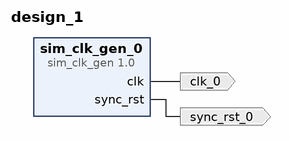
[diagram p0: block diagram of the top level]
# Vivado block design design_1, xc7a35tcpg236-1, Vivado 2017.4
create_bd_design design_1

create_bd_port -dir O -type clk clk_0
create_bd_port -dir O -type rst sync_rst_0

create_bd_cell -type ip -vlnv xilinx.com:ip:sim_clk_gen:1.0 sim_clk_gen_0
set_property -dict {CONFIG.RESET_POLARITY ACTIVE_LOW} [get_bd_cells sim_clk_gen_0]

# ---- connections ----

connect_bd_net [get_bd_pins sim_clk_gen_0/clk] [get_bd_ports clk_0]
connect_bd_net [get_bd_pins sim_clk_gen_0/sync_rst] [get_bd_ports sync_rst_0]

validate_bd_design
save_bd_design
